# EAGLE design SNAC  7ch SNES in Housing - Multitap (EAGLE 9.0.1)
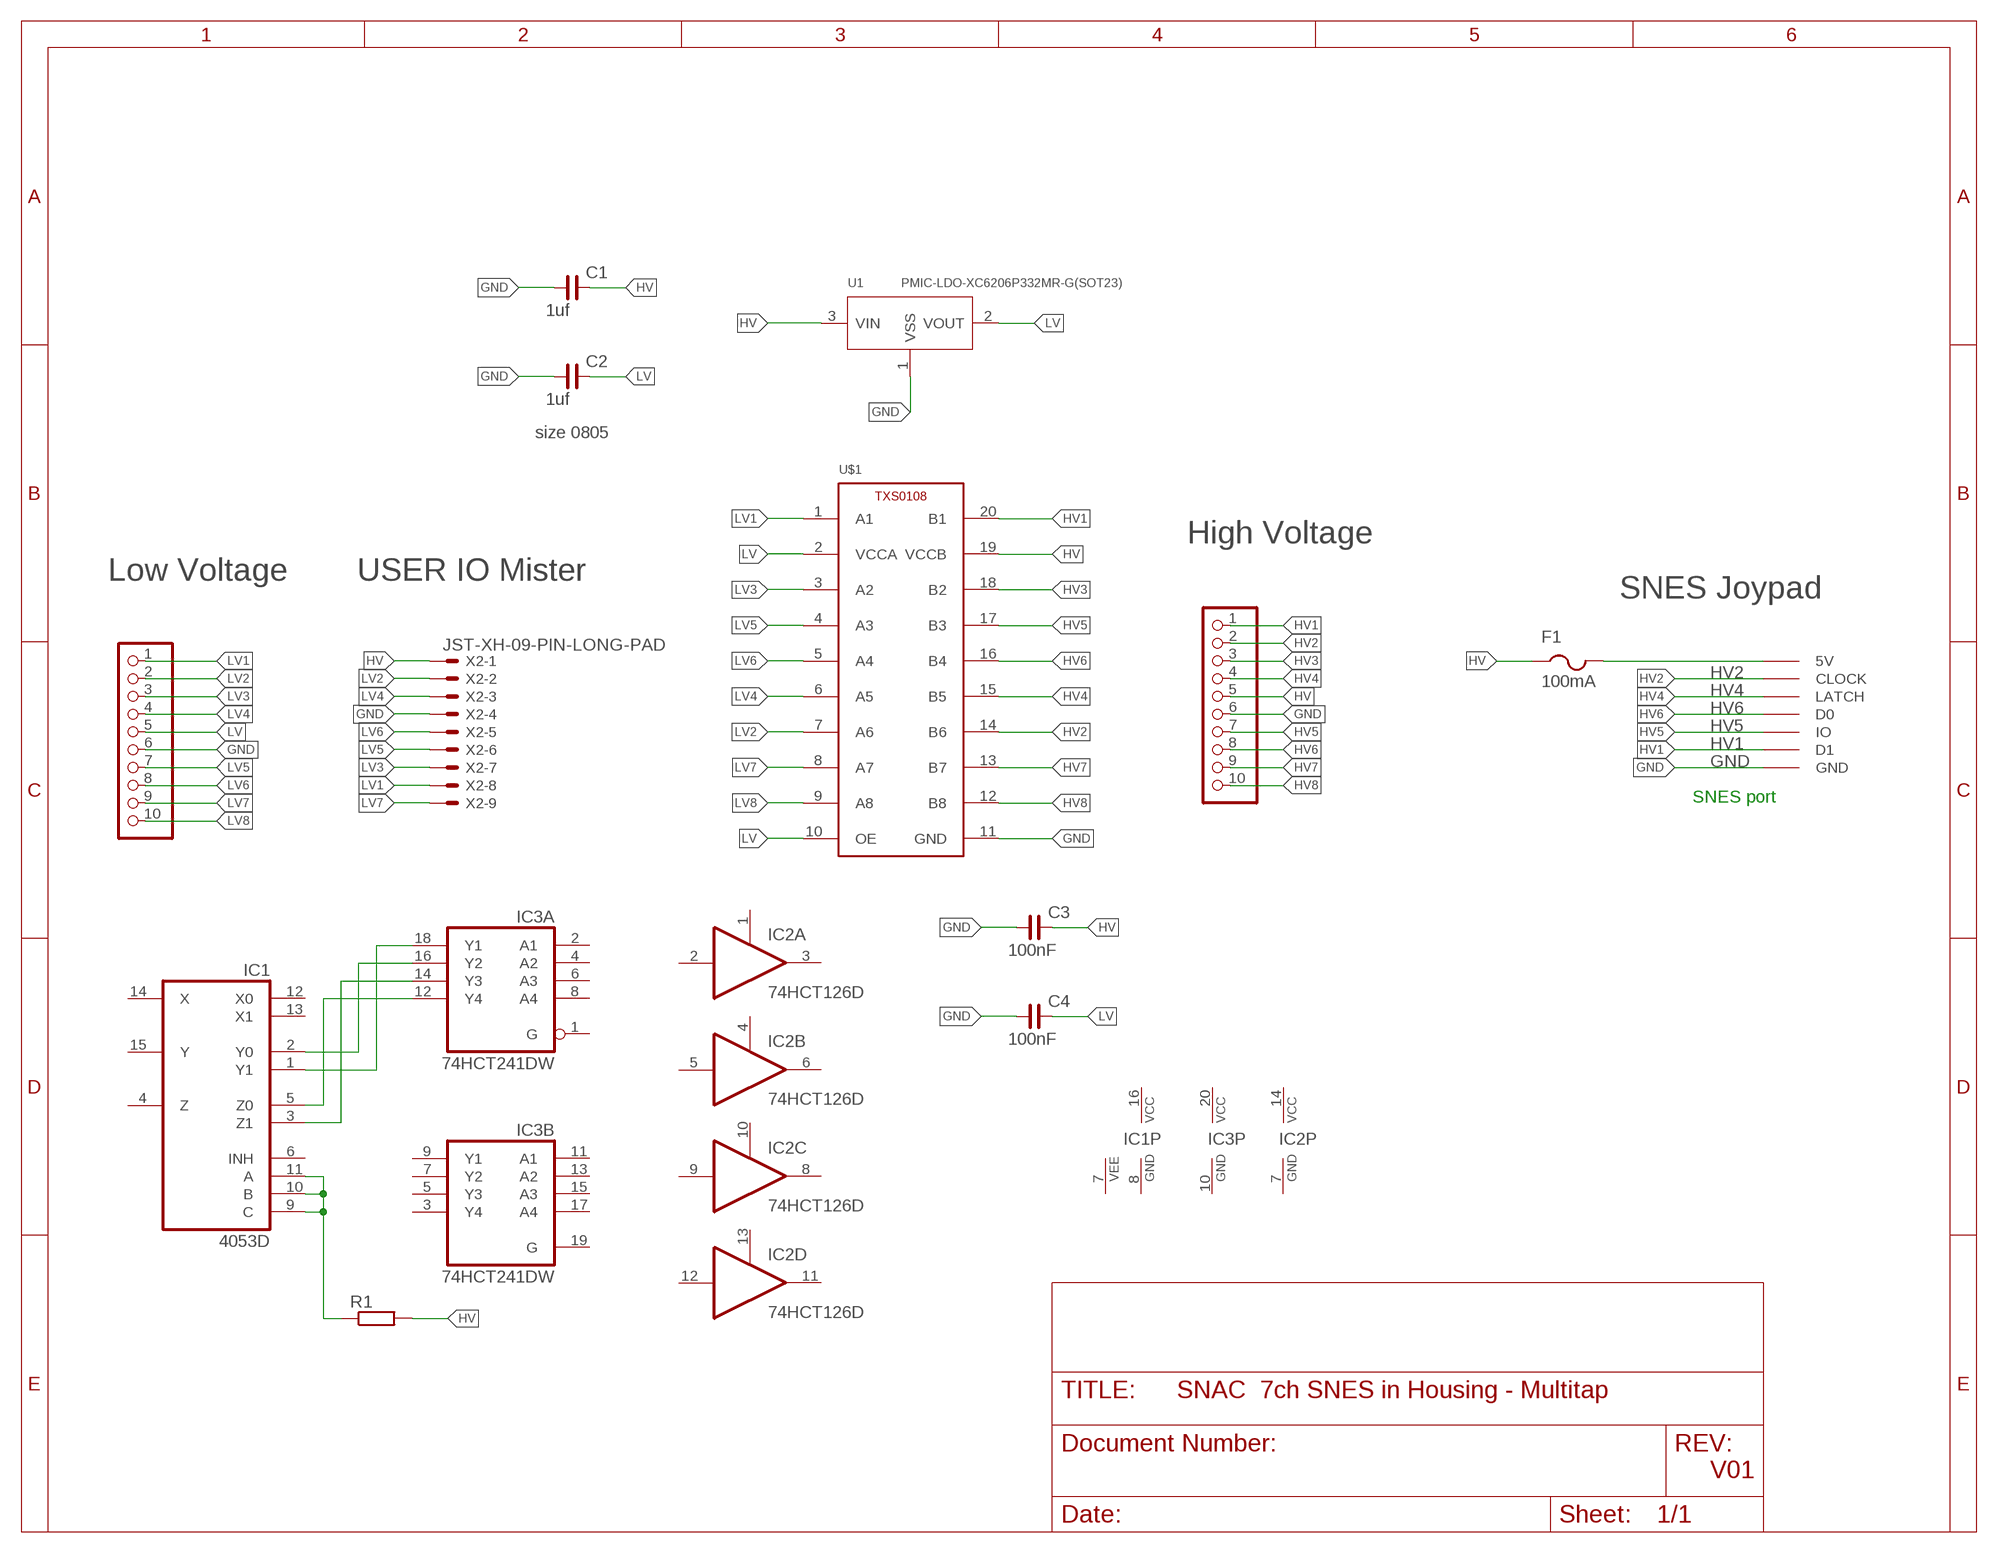
[diagram p0: schematic, sheet 1]

## Parts
C1  1uf  C_0805  [C0805]
C2  1uf  C_0805  [C0805]
C3  100nF  C_0805  [C0805]
C4  100nF  C_0805  [C0805]
F1  100mA  PTCFUSE-1206  [R1206]
IC1  4053D  [SO16]
IC2  74HCT126D  [SO14]
IC3  74HCT241DW  [SO20W]
JP1  PINHD-1X10_2.54-S  [1X10-S]
JP2  PINHD-1X10_2.54-S  [1X10-S]
R1  R-EU_R0805  [R0805]
U1  PMIC-LDO-XC6206P332MR-G(SOT23)  [SOT-23]
U$1  TXS0108  [R-PUSON-N20]
U$3  SNESCONN  [SNESCONN]
X2  JST-XH-09-PIN-LONG-PAD  [JST-XH-09-PACKAGE-LONG-PAD]

## Nets
GND: C1.1 C2.1 C3.1 C4.1 JP1.6 JP2.6 U1.1(VSS) U$1.11(GND) U$3.GND X2.4
HV: C1.2 C3.2 F1.1 JP2.5 R1.2 U1.3(VIN) U$1.19(VCCB) X2.1
HV1: JP2.1 U$1.20(B1) U$3.D1
HV2: JP2.2 U$1.14(B6) U$3.CLOCK
HV3: JP2.3 U$1.18(B2)
HV4: JP2.4 U$1.15(B5) U$3.LATCH
HV5: JP2.7 U$1.17(B3) U$3.IO
HV6: JP2.8 U$1.16(B4) U$3.D0
HV7: JP2.9 U$1.13(B7)
HV8: JP2.10 U$1.12(B8)
LV: C2.2 C4.2 JP1.5 U1.2(VOUT) U$1.2(VCCA) U$1.10(OE)
LV1: JP1.1 U$1.1(A1) X2.8
LV2: JP1.2 U$1.7(A6) X2.2
LV3: JP1.3 U$1.3(A2) X2.7
LV4: JP1.4 U$1.6(A5) X2.3
LV5: JP1.7 U$1.4(A3) X2.6
LV6: JP1.8 U$1.5(A4) X2.5
LV7: JP1.9 X2.9
LV8: JP1.10 U$1.9(A8)
N$5: F1.2 U$3.5V
N$6: U$1.8(A7)
N$7: IC1.2(Y0) IC3.16(A:Y2)
N$14: IC1.1(Y1) IC3.18(A:Y1)
N$15: IC1.3(Z1) IC3.14(A:Y3)
N$16: IC1.5(Z0) IC3.12(A:Y4)
N$17: IC1.9(C) IC1.10(B) IC1.11(A) R1.1
Unconnected: IC1.4(Z) IC1.6(INH) IC1.12(X0) IC1.13(X1) IC1.14(X) IC1.15(Y) IC2.1(A:OE) IC2.2(A:I) IC2.3(A:O) IC2.4(B:OE) IC2.5(B:I) IC2.6(B:O) IC2.8(C:O) IC2.9(C:I) IC2.10(C:OE) IC2.11(D:O) IC2.12(D:I) IC2.13(D:OE) IC3.1(A:G) IC3.2(A:A1) IC3.3(B:Y4) IC3.4(A:A2) IC3.5(B:Y3) IC3.6(A:A3) IC3.7(B:Y2) IC3.8(A:A4) IC3.9(B:Y1) IC3.11(B:A1) IC3.13(B:A2) IC3.15(B:A3) IC3.17(B:A4) IC3.19(B:G)

## Notes on the sheet
- size 0805
- High Voltage
- Low Voltage | USER IO Mister
- SNES Joypad
- SNES port
- V01

## Power pins joined to a net without a drawn wire
GND: IC1.8(GND) IC2.7(P:GND) IC3.10(P:GND)
VCC: IC1.16(VCC) IC2.14(P:VCC) IC3.20(P:VCC)
VEE: IC1.7(VEE)

## Library data of the parts
C1-C4 = rc-master-smd:C_: NON-POLARIZED CAP
F1 = adafruit:PTCFUSE: PTC fuses, resettable thermistors
IC1 = 40xx:4053: Triple 2-channel ANALOG MULTIPLEXER
IC2 = 74xx-eu:74*126: Quad bus BUFFER, 3-state
IC3 = 74xx-eu:74*241: Octal BUFFER and LINE DRIVER, 3-state
JP1 JP2 = pinhead-2:PINHD-1X10: PIN HEADER
R1 = rcl:R-EU_: RESISTOR, European symbol; SPICEPREFIX: R
U1 = PMIC-LDO-XC6206P332MR-G_SOT23_:PMIC-LDO-XC6206P332MR-G(SOT23): 310030099; AVAILABILITY: Unavailable; DESCRIPTION: SMD PMIC; LDO; Vin 6V; 3.3V; 200mA; Without En; 1-Ch; MF: Torex; MP: XC6206P332MR-G; PACKAGE: SOT-23-3 Torex; PRICE: None
U$1 = FaBo-LevelTranslator:TXS0108
U$3 = gamepad-conn:SNESCONN
X2 = Rembrandt Electronics - JST XH Connectors v1-0:JST-XH-09-PIN: JST XH Connector 2 Pin Wire to board connector. Pitch: 2,54 mm, (0.100") Number of pins: 9 Created by Rembrandt Electronics www.rembrandtelectronics.com

## Board
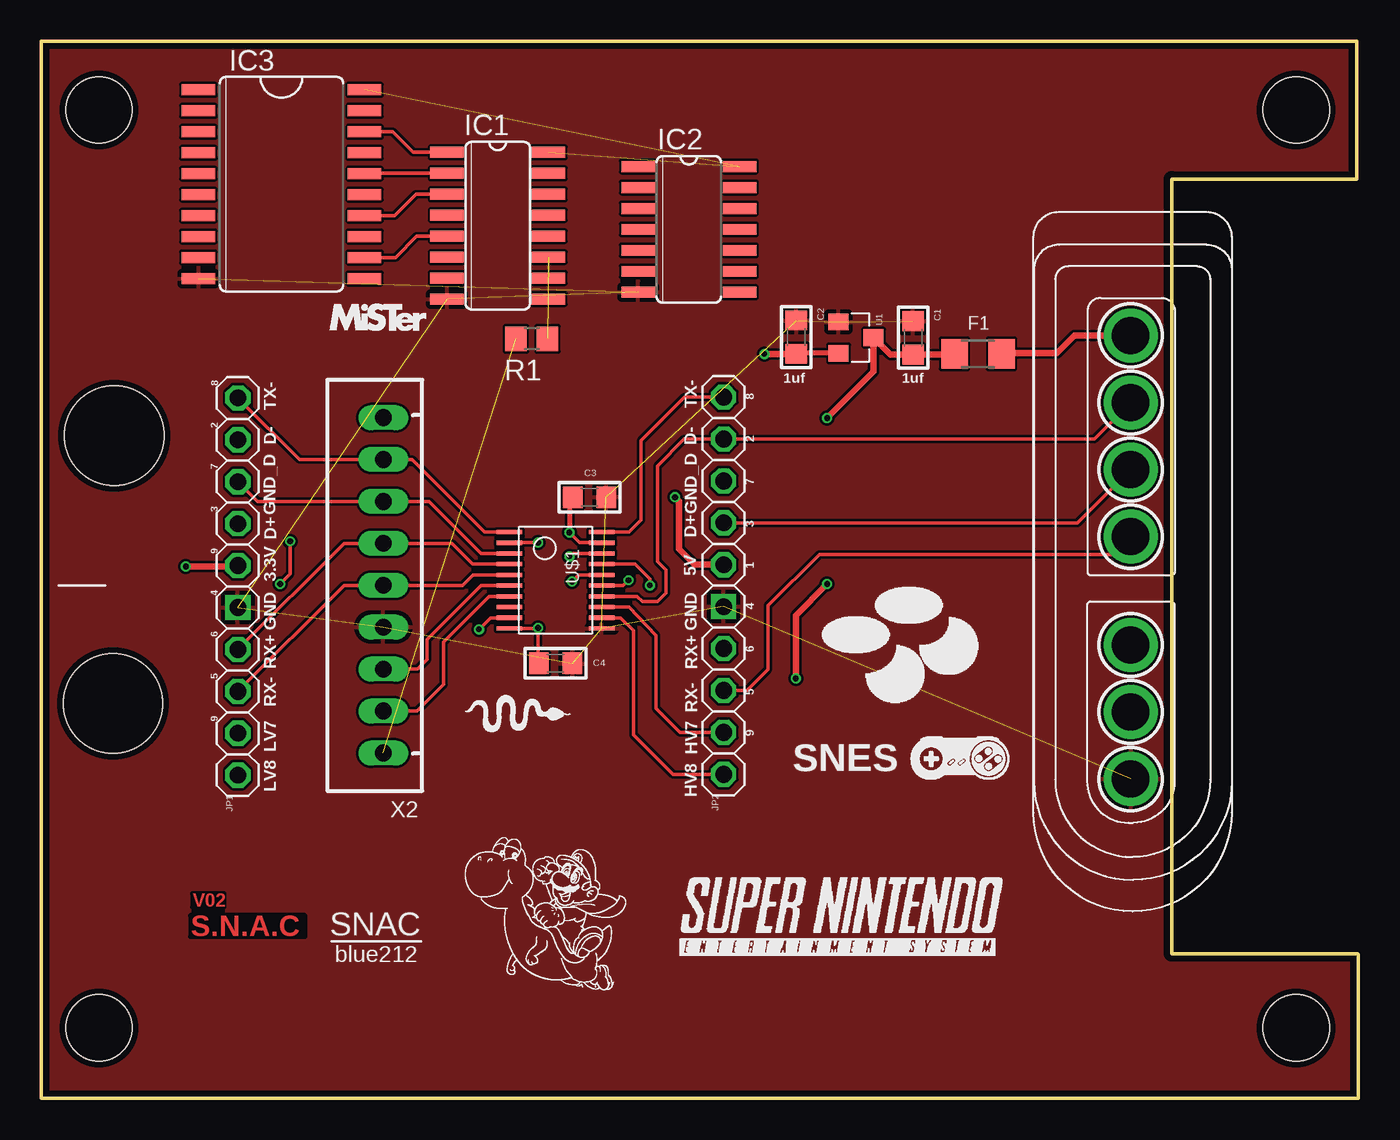
[diagram p1: board, top side]
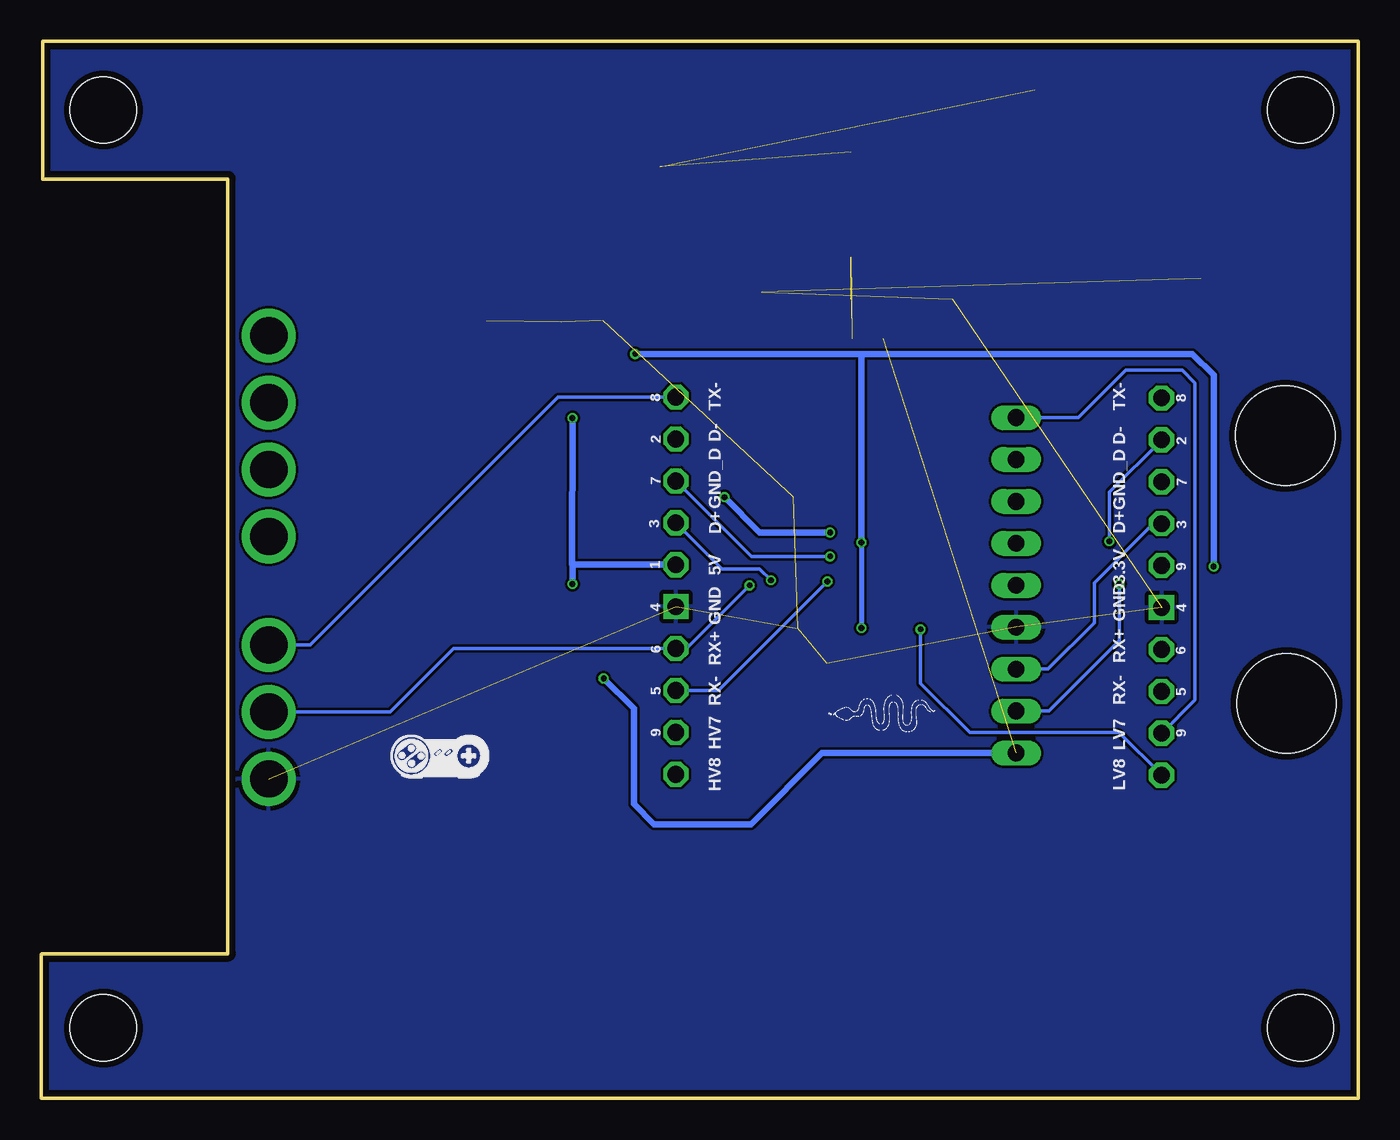
[diagram p2: board, bottom side, seen from below]

Size 79.81 x 64.06 mm. Coordinates in mm from the lower left corner, seen from the top.
Outline: 0,64.06 0,0 79.81,0 79.81,8.74 79.78,8.76 68.5,8.76 68.5,55.7 79.71,55.7 79.71,64.06 0,64.06
Copper layers (1*16): Top 0.035559375mm / dielectric 1.6mm / Bottom 0.035559375mm
Design rules "oshpark-2layer": minimum track width 6mil, minimum drill 10mil, track to track 6mil, track to pad 6mil, pad to pad 6mil, via to via 6mil, smd to smd 6mil, copper to edge 15mil, drill to drill 6mil, minimum pad ring 5mil, minimum via ring 5mil, stop-mask expansion 2.5mil, vias tented up to drill 0mil, thermal gap 10mil
Holes 4 mm at 3.51,59.89 76.05,59.89 3.51,4.27 76.05,4.27
Holes 6 mm at 4.42,40.16 4.34,23.93

### Footprints (pad centres in the part's own frame; a part is rotated, then mirrored left to right if it is on the bottom)
C0805 = smd 1.2 x 1.3: 1 -1.016,0; 2 1.016,0
R1206 = smd 1.6 x 1.803: 1 -1.422,0; 2 1.422,0
SO16 = smd 0.66 x 2.032: 1 -4.445,-3.073; 2 -3.175,-3.073; 3 -1.905,-3.073; 4 -0.635,-3.073; 5 0.635,-3.073; 6 1.905,-3.073; 7 3.175,-3.073; 8 4.445,-3.073; 9 4.445,3.073; 10 3.175,3.073; 11 1.905,3.073; 12 0.635,3.073; 13 -0.635,3.073; 14 -1.905,3.073; 15 -3.175,3.073; 16 -4.445,3.073
SO14 = smd 0.66 x 2.032: 1 -3.81,-3.073; 2 -2.54,-3.073; 3 -1.27,-3.073; 4 0,-3.073; 5 1.27,-3.073; 6 2.54,-3.073; 7 3.81,-3.073; 8 3.81,3.073; 9 2.54,3.073; 10 1.27,3.073; 11 0,3.073; 12 -1.27,3.073; 13 -2.54,3.073; 14 -3.81,3.073
SO20W = smd 0.66 x 2.032: 1 -5.715,-5.029; 2 -4.445,-5.029; 3 -3.175,-5.029; 4 -1.905,-5.029; 5 -0.635,-5.029; 6 0.635,-5.029; 7 1.905,-5.029; 8 3.175,-5.029; 9 4.445,-5.029; 10 5.715,-5.029; 11 5.715,5.029; 12 4.445,5.029; 13 3.175,5.029; 14 1.905,5.029; 15 0.635,5.029; 16 -0.635,5.029; 17 -1.905,5.029; 18 -3.175,5.029; 19 -4.445,5.029; 20 -5.715,5.029
1X10-S = drill 1.016 octagon: 1 -11.43,0; 2 -8.89,0; 3 -6.35,0; 4 -3.81,0; 5 -1.27,0; 7 3.81,0; 8 6.35,0; 9 8.89,0; 10 11.43,0 | drill 1.016 square: 6 1.27,0
R0805 = smd 1.3 x 1.5: 1 -0.95,0; 2 0.95,0
SOT-23 = smd 1.016 x 1.2: 1 -0.95,-1.06; 2 0.95,-1.06; 3 0,1.06
R-PUSON-N20 = smd 0.25 x 1.55: 1 -2.925,-2.8; 2 -2.275,-2.8; 3 -1.625,-2.8; 4 -0.975,-2.8; 5 -0.325,-2.8; 6 0.325,-2.8; 7 0.975,-2.8; 8 1.625,-2.8; 9 2.275,-2.8; 10 2.925,-2.8; 11 2.925,2.8; 12 2.275,2.8; 13 1.625,2.8; 14 0.975,2.8; 15 0.325,2.8; 16 -0.325,2.8; 17 -0.975,2.8; 18 -1.625,2.8; 19 -2.275,2.8; 20 -2.925,2.8
SNESCONN = drill 2.25 pad 3.25: 5V 0,4.064; CLOCK 4.064,4.064; D0 12.192,4.064; D1 18.756,4.064; GND 26.884,4.064; IO 22.82,4.064; LATCH 8.128,4.064
JST-XH-09-PACKAGE-LONG-PAD = drill 1.016 long: 1 -10.16,0; 2 -7.62,0; 3 -5.08,0; 4 -2.54,0; 5 0,0; 6 2.54,0; 7 5.08,0; 8 7.62,0; 9 10.16,0

### Placement (x,y rotation side)
C1  52.83,46.09 270 top
C2  45.76,46.13 270 top
C3  33.22,36.42 180 top
C4  31.17,26.37 180 top
F1  56.77,45.11 0 top
IC1  27.66,52.88 270 top
IC2  39.24,52.65 270 top
IC3  14.55,55.4 270 top
JP1  11.91,31.01 270 top
JP2  41.35,31.06 270 top
R1  29.72,46.02 180 top
U1  49.38,46.1 270 top
U$1  31.17,31.39 270 top
U$3  61.95,46.23 270 top
X2  20.73,31.09 90 top

### Tracks (layer width: path | path; a pad name or v marks a point on that pad's centre or on a via)
GND  (12 unrouted)
  pour Top: 79.58,64.01 79.63,64.01 79.71,55.7 68.5,55.7 68.5,8.76 79.78,8.76 79.78,0.03 0.03,0.05 0.08,63.98
  pour Bottom: 79.63,64.01 79.71,55.7 68.5,55.7 68.5,8.76 79.78,8.76 79.78,-0.03 0.03,0.05 0.08,64.01
HV  (via drill 0.35)  (1 unrouted)
  Top 0.203: v32,34.29 32.62,33.67 U$1.19
  Top 0.305: C3.2 32,36.22 v32,34.29
  Top 0.406: U1.3 51.46,45.07 C1.2 55.31,45.07 F1.1 | 50.29,45.96 U1.3 | v47.63,31.17 45.72,29.26 v45.72,25.45 | JP2.5 39.6,32.33 38.63,33.3 38.63,36.2 v38.41,36.42 | v47.63,41.22 50.44,44.04 U1.3
  Bottom 0.406: JP2.5 47.65,32.33 | 47.65,32.33 v47.63,41.22 | v47.63,31.17 47.63,32.31 47.65,32.33 | v38.41,36.42 36.27,34.29 v32,34.29 | X2.1 32.49,20.93 36.8,16.61 42.67,16.61 43.89,17.83 43.89,23.62 v45.72,25.45
HV1
  Top 0.203: JP2.1 38.99,42.49 36.35,39.85 36.35,35.05 35.62,34.32 U$1.20
  Bottom 0.203: U$3.D1 63.51,27.47 48.49,42.49 JP2.1
HV2
  Top 0.203: U$3.CLOCK 63.81,39.95 JP2.2 38.96,39.95 37.34,38.33 37.34,32.54 37.87,32 37.87,30.63 37.34,30.1 36.42,30.1 36.1,30.42 U$1.14
HV3  (via drill 0.35)
  Top 0.203: v32,32.84 32.18,33.02 U$1.18
  Bottom 0.203: v32,32.84 36.78,32.84 JP2.3
HV4  (via drill 0.35)
  Top 0.203: JP2.4 62.79,34.87 U$3.LATCH | U$1.15 35.26,31.07 v35.59,31.39
  Bottom 0.203: v35.59,31.39 36.27,32.08 38.56,32.08 JP2.4
HV5  (via drill 0.35)
  Top 0.203: U$1.17 35.98,32.37 36.88,31.47 v36.88,31.09
  Bottom 0.203: U$3.IO 58.66,23.41 54.81,27.25 JP2.7 40.72,27.25 v36.88,31.09
HV6  (via drill 0.35)
  Top 0.203: JP2.8 42.77,24.71 44.04,25.98 44.04,29.87 47.14,32.97 64.95,32.97 U$3.D0 | v32.16,31.32 32.56,31.72 U$1.16
  Bottom 0.203: v32.16,31.32 38.76,24.71 JP2.8
HV7
  Top 0.203: JP2.9 38.71,22.17 37.26,23.62 37.26,28.04 35.61,29.77 U$1.13
HV8
  Top 0.203: JP2.10 38.28,19.63 35.89,22.02 35.89,28.35 35.12,29.12 U$1.12
LV  (via drill 0.35)
  Top 0.203: U$1.2 v30.09,33.67 v30.1,33.68 | U$1.10 30.07,28.47 v30.1,28.5 30.1,26.42 C4.2
  Top 0.305: U1.2 45.8,45.15 C2.2
  Top 0.406: v43.82,45.11 C2.2 | JP1.5 11.86,32.23 v8.76,32.23
  Bottom 0.305: v30.1,33.68 v30.1,28.5
  Bottom 0.406: 30.1,45.11 v43.82,45.11 | v30.1,33.68 30.1,45.11 | 30.1,45.11 10.06,45.11 8.76,43.82 v8.76,32.23
LV1
  Top 0.203: JP1.1 15.65,38.71 X2.8 22.48,38.71 26.87,34.32 U$1.1
LV2  (via drill 0.35)
  Top 0.203: v15.09,33.76 15.09,31.78 v14.48,31.17 | X2.2 22.78,23.47 24.38,25.07 24.38,27.66 27.14,30.42 U$1.7
  Bottom 0.203: JP1.2 15.09,36.73 v15.09,33.76 | X2.2 18.75,23.47 14.48,27.74 v14.48,31.17
LV3
  Top 0.203: JP1.3 13.11,36.17 X2.7 23.5,36.17 26.65,33.02 U$1.3
LV4
  Top 0.203: X2.3 22.81,26.01 23.39,26.59 23.39,27.81 26.65,31.07 U$1.6
  Bottom 0.203: JP1.4 12.42,34.82 16,31.24 16,28.8 18.8,26.01 X2.3
LV5
  Top 0.203: JP1.7 18.34,33.63 X2.6 24.89,33.63 26.15,32.37 U$1.4
LV6
  Top 0.203: 20.75,31.07 X2.5 | JP1.8 18.34,31.09 X2.5 | X2.5 25.53,31.09 26.16,31.72 U$1.5
LV7
  Bottom 0.2: 9.91,43.36 10.67,44.12 14.1,44.12 16.97,41.25 X2.9
  Bottom 0.203: JP1.9 9.91,24.13 9.91,43.36
LV8  (via drill 0.35)
  Top 0.203: v26.52,28.42 27.21,29.12 U$1.9
  Bottom 0.203: JP1.10 14.5,22.17 23.55,22.17 26.52,25.15 v26.52,28.42
N$5
  Top 0.406: F1.2 58.24,45.16 61.54,45.16 62.61,46.23 U$3.5V
N$7
  Top 0.203: IC1.2 19.61,56.06 IC3.16
N$14
  Top 0.203: IC1.1 22.53,57.33 21.29,58.57 IC3.18
N$15
  Top 0.203: IC1.3 22.71,54.79 21.41,53.49 IC3.14
N$16
  Top 0.203: IC1.5 22.76,52.25 21.46,50.95 IC3.12
N$17  (3 unrouted)
VCC  (2 unrouted)

### Text on the board
Top: V02 | S.N.A.C
tPlace: 8 | TX- | TX- | 1uf | 1uf | 8 | 2 | D- | D- | 2 | GND_D | GND_D | 7 | 7 | 3 | D+ | D+ | 3 | 9 | 3.3V | 5V | 1 | 4 | GND | GND | 4 | 6 | RX+ | 6 | RX+ | 5 | RX- | 5 | 9 | LV7 | RX- | 9 | LV8 | HV7 | SNES | HV8 | SNAC | blue212
bPlace: 8 | 8 | TX- | TX- | 2 | D- | D- | 2 | 7 | 7 | GND_D | GND_D | 3 | D+ | D+ | 3 | 9 | 1 | 3.3V | 5V | 4 | GND | 4 | GND | 6 | 6 | RX+ | RX+ | 5 | 5 | RX- | RX- | 9 | 9 | LV7 | HV7 | LV8 | HV8
tValues: + | - | + | -